# Altium schematic sheet VelostatTest.SchDoc
size A portrait
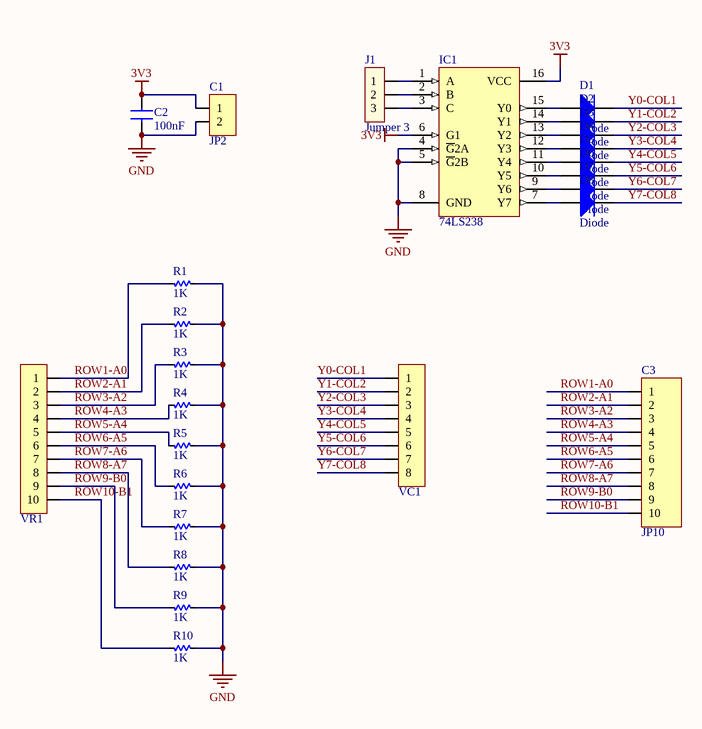
[diagram p0: VelostatTest.SchDoc]

## Parts
C1  JP2  [JP2-D1T]
C2  Capacitance: 100nF  [C0805-2.01-1.25-0.94]  (hidden comment: Capacitor 0805)
C3  JP10  [JP10-D1T]
D1  Diode  [SOD-123F]
D2  Diode  [SOD-123F]
D3  Diode  [SOD-123F]
D4  Diode  [SOD-123F]
D5  Diode  [SOD-123F]
D6  Diode  [SOD-123F]
D7  Diode  [SOD-123F]
D8  Diode  [SOD-123F]
IC1  74LS238  [SO16]
J1  Jumper 3  [JP3]
R1  Resistance: 1K  [R0805]  (hidden comment: Resistor 0805)
R2  Resistance: 1K  [R0805]  (hidden comment: Resistor 0805)
R3  Resistance: 1K  [R0805]  (hidden comment: Resistor 0805)
R4  Resistance: 1K  [R0805]  (hidden comment: Resistor 0805)
R5  Resistance: 1K  [R0805]  (hidden comment: Resistor 0805)
R6  Resistance: 1K  [R0805]  (hidden comment: Resistor 0805)
R7  Resistance: 1K  [R0805]  (hidden comment: Resistor 0805)
R8  Resistance: 1K  [R0805]  (hidden comment: Resistor 0805)
R9  Resistance: 1K  [R0805]  (hidden comment: Resistor 0805)
R10  Resistance: 1K  [R0805]  (hidden comment: Resistor 0805)
VC1  VELOSTAT COL  [VELOSTAT COL]  (value not drawn)
VR1  VELOSTAT ROW  [VELOSTAT ROW]  (value not drawn)

## Nets
3V3: C1.1 C2.2 IC1.6(G1) IC1.16(VCC)
GND: C1.2 C2.1 IC1.4(~{G}2A) IC1.5(~{G}2B) IC1.8(GND) R1.2 R2.2 R3.2 R4.2 R5.2 R6.2 R7.2 R8.2 R9.2 R10.2
ROW1-A0: C3.1 R1.1 VR1.1
ROW2-A1: C3.2 R2.1 VR1.2
ROW3-A2: C3.3 R3.1 VR1.3
ROW4-A3: C3.4 R4.1 VR1.4
ROW5-A4: C3.5 R5.1 VR1.5
ROW6-A5: C3.6 R6.1 VR1.6
ROW7-A6: C3.7 R7.1 VR1.7
ROW8-A7: C3.8 R8.1 VR1.8
ROW9-B0: C3.9 R9.1 VR1.9
ROW10-B1: C3.10 R10.1 VR1.10
Y0-COL1: D1.2(K) VC1.1
Y1-COL2: D2.2(K) VC1.2
Y~{2}-COL3: D3.2(K) VC1.3
Y3-COL4: D4.2(K) VC1.4
Y4-COL5: D5.2(K) VC1.5
Y5-COL6: D6.2(K) VC1.6
Y6-COL7: D7.2(K) VC1.7
Y7-COL8: D8.2(K) VC1.8
NetD1_1: D1.1(A) IC1.15(Y0)
NetD2_1: D2.1(A) IC1.14(Y1)
NetD3_1: D3.1(A) IC1.13(Y2)
NetD4_1: D4.1(A) IC1.12(Y3)
NetD5_1: D5.1(A) IC1.11(Y4)
NetD6_1: D6.1(A) IC1.10(Y5)
NetD7_1: D7.1(A) IC1.9(Y6)
NetD8_1: D8.1(A) IC1.7(Y7)
NetIC1_1: IC1.1(A) J1.1
NetIC1_2: IC1.2(B) J1.2
NetIC1_3: IC1.3(C) J1.3

## Notes on the sheet
- Title
- Size:
- Date:
- A4
- Number:
- Time:
- Revision:
- Sheet
- of
- File:

## Library data of the parts
C1 = JP2: WR-PHD 2.54 mm Angled Socket Header; Manufacturer: W¨¹rth Elektronik eiSos GmbH; partNo: 613002143121; ComponentLink1 Description: Manufacturer; ComponentLink2 Description: Datasheet; NoPins: 02; Created Date: 29 March 2013; ComponentLink1URL: http://www.we-online.com; ComponentLink2URL: http://katalog.we-online.de/em/datasheet/6130xx143121.pdf; Created by: Karrer Zheng
C2 = CAP 0805: CAP CER 50V 0805; Manufacturer: Panasonic; Manufacturer Part Number: ECJ-2FB1H104K; Tolerance: 10%; Dielectric: X7R; Supplier 1: Arrow Electronics; RoHS: Yes; Category: Ceramic Capacitors; Mount: Surface Mount; Case/Package: 0805; Case Code (Metric): 2012; Case Code (Imperial): 0805; Min Operating Temperature: -55°C; Max Operating Temperature: 125°C; Packaging: Tape and Reel; Package Quantity: 3000; Voltage Rating: 50V; Voltage Rating (DC): 50V; Length: 0.079inch; Width: 0.049inch; Thickness: 0.055inch; Depth: 1.25mm; RoHS Compliant: Yes; ComponentLink1URL: https://datasheet.ciiva.com/6267/ecj-general-6267311.pdf?src-supplier=Digi-Key; ComponentLink1Description: https://datasheet.ciiva.com/6267/ecj-general-6267311.pdf?src-supplier=Digi-Key; ComponentLink2URL: https://datasheet.ciiva.com/6267/ecj-general-6267304.pdf?src-supplier=Digi-Key; ComponentLink2Description: https://datasheet.ciiva.com/6267/ecj-general-6267304.pdf?src-supplier=Digi-Key; ComponentLink3URL: https://datasheet.ciiva.com/6267/ecj-general-6267308.pdf?src-supplier=Digi-Key; ComponentLink3Description: https://datasheet.ciiva.com/6267/ecj-general-6267308.pdf?src-supplier=Digi-Key; Supplier Part Number 1: ECJ-2FB1H104K
C3 = JP10: WR-PHD 2.54 mm Angled Socket Header; Manufacturer: W¨¹rth Elektronik eiSos GmbH; partNo: 613010143121; ComponentLink1 Description: Manufacturer; ComponentLink2 Description: Datasheet; NoPins: 10; Created Date: 29 March 2013; ComponentLink1URL: http://www.we-online.com; ComponentLink2URL: http://katalog.we-online.de/em/datasheet/6130xx143121.pdf; Created by: Karrer Zheng
D1-D8 = DIODE: Default Diode; Published: 8-Jun-2000; LatestRevisionDate: 17-Jul-2002; LatestRevisionNote: Re-released for DXP Platform.; PackageVersion: Sep-1996; PackageReference: SMC; Publisher: Altium Limited; Code_JEDEC: DO-214-AB
IC1 = 74238: 3 -to- 8 Decoder - Out High; Value: 74LS238; Copyright by: VanDungEvn@Gmail.com
J1 = JP3: Value: J3
R1-R10 = RES 0805: TE CONNECTIVITY / CGS - RH73H2A100MKTN - RES, THICK FILM, 100M, 10%, 0.125W, 0805; Temperature Coefficient: 100ppm/°C; Max Power Dissipation: 125mW; Voltage Rating: 100V; Number of Resistors: 1; Supplier 1: Digi-Key; Manufacturer: TE Connectivity; Manufacturer Part Number: RH73H2A100MKTN; RoHS: Yes; Category: Chip SMD Resistors; Stock 1: 13395; Pricing 1: 1=1.07000, 10=0.94900, 100=0.68920 (USD); Mount: Surface Mount; Case/Package: 0805; Case Code (Imperial): 0805; Case Code (Metric): 2012; Min Operating Temperature: -55°C; Max Operating Temperature: 125°C; Packaging: Tape and Reel; Tolerance: 10%; Resistor Type: Thick Film; Number of Terminations: 2; Series: RH73; Power Rating: 125mW; Termination: Solder; Resistance Tolerance: 10%; Technology: THICK FILM; Length: 2mm; Width: 1.2mm; Height: 0.4mm; Depth: 1.2mm; Radiation Hardening: No; RoHS Compliant: Yes; REACH SVHC: Unknown; ELV: Compliant; ComponentLink1URL: https://datasheet.ciiva.com/11812/0900766b80028b3d-11812403.pdf?src-supplier=RSComponents; ComponentLink1Description: https://datasheet.ciiva.com/11812/0900766b80028b3d-11812403.pdf?src-supplier=RSComponents; ComponentLink2URL: https://datasheet.ciiva.com/7712/585397-7712010.pdf?src-supplier=Element14; ComponentLink2Description: https://datasheet.ciiva.com/7712/585397-7712010.pdf?src-supplier=Element14; ComponentLink3URL: https://datasheet.ciiva.com/7712/585397-7712011.pdf?src-supplier=Element14; ComponentLink3Description: https://datasheet.ciiva.com/7712/585397-7712011.pdf?src-supplier=Element14; ComponentLink4URL: https://datasheet.ciiva.com/12562/eng-ds-1773268-a-12562988.pdf?src-supplier=Mouser; ComponentLink4Description: https://datasheet.ciiva.com/12562/eng-ds-1773268-a-12562988.pdf?src-supplier=Mouser; ComponentLink5URL: https://datasheet.ciiva.com/16756/70064396-16756222.pdf?src-supplier=Allied+Electronics; ComponentLink5Description: https://datasheet.ciiva.com/16756/70064396-16756222.pdf?src-supplier=Allied+Electronics; Supplier Part Number 1: A106111CT-ND
VC1 = VELOSTAT COL: 8 columns to test a sensor with 8x8 dot matrix
VR1 = VELOSTAT ROW: 10 rows to test a sensor with 8x8 dot matrix